# Altium schematic sheet Battery_Management.SchDoc
size A4; SheetNumber: 2
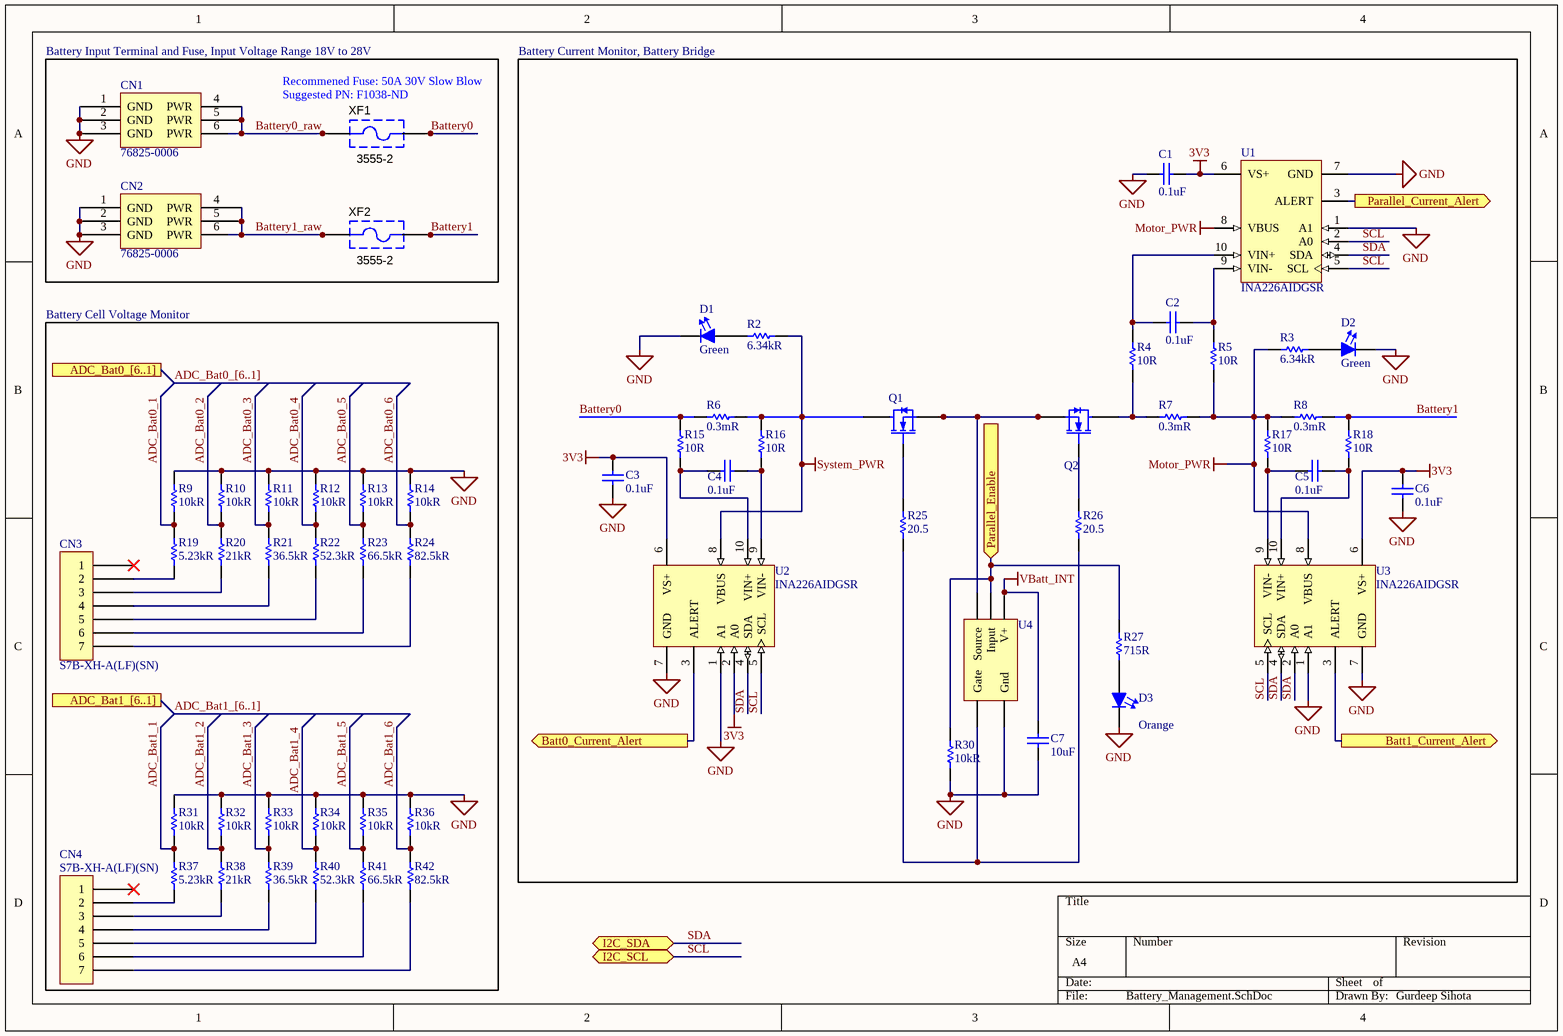
[diagram p0: Battery_Management.SchDoc]

## Parts
C1  Capacitance: 0.1uF  [FP-CL10-0_1-IPC_A]  (hidden comment: CL10B104JB8NNNC)
C2  Capacitance: 0.1uF  [FP-CL10-0_1-IPC_A]  (hidden comment: CL10B104JB8NNNC)
C3  Capacitance: 0.1uF  [FP-CL10-0_1-IPC_A]  (hidden comment: CL10B104JB8NNNC)
C4  Capacitance: 0.1uF  [FP-CL10-0_1-IPC_A]  (hidden comment: CL10B104JB8NNNC)
C5  Capacitance: 0.1uF  [FP-CL10-0_1-IPC_A]  (hidden comment: CL10B104JB8NNNC)
C6  Capacitance: 0.1uF  [FP-CL10-0_1-IPC_A]  (hidden comment: CL10B104JB8NNNC)
C7  Capacitance: 10uF  [CAPC3216X180X50ML20T30]  (hidden comment: CL31B106KBHNNNE)
CN1  76825-0006  [76825-0006-Footprint-1]
CN2  76825-0006  [76825-0006-Footprint-1]
CN3  S7B-XH-A(LF)(SN)  [S7B-XH-A(LF)(SN)-Footprint-1]
CN4  S7B-XH-A(LF)(SN)  [S7B-XH-A(LF)(SN)-Footprint-1]
D1  Color: Green  [FP-LB_Q39E-MFG]  (hidden comment: LT Q39G-Q1OO-25-1)
D2  Color: Green  [FP-LB_Q39E-MFG]  (hidden comment: LT Q39G-Q1OO-25-1)
D3  Colour: Orange  [LED0805]  (hidden comment: LED, 0805 (2012), Orange, Clear)
Q1  MOSFET N-Channel, 40V, 100A, 272W  [LFPAK-PowerSO8]  (value not drawn)
Q2  MOSFET N-Channel, 40V, 100A, 272W  [LFPAK-PowerSO8]  (value not drawn)
R2  Resistance: 6.34kR  [RESC1609X50X30ML10T20]  (hidden comment: CRCW06036K34FKEA)
R3  Resistance: 6.34kR  [RESC1609X50X30ML10T20]  (hidden comment: CRCW06036K34FKEA)
R4  Resistance: 10R  [FP-ERJ3EK-IPC_A]  (hidden comment: ERJ3EKF10R0V)
R5  Resistance: 10R  [FP-ERJ3EK-IPC_A]  (hidden comment: ERJ3EKF10R0V)
R6  Resistance: 0.3mR  [RESC6332N(2512")]  (hidden comment: HCS2512FTL300)
R7  Resistance: 0.3mR  [RESC6332N(2512")]  (hidden comment: HCS2512FTL300)
R8  Resistance: 0.3mR  [RESC6332N(2512")]  (hidden comment: HCS2512FTL300)
R9  Resistance: 10kR  [RESC1608X55X25ML10T15]  (hidden comment: RC0603FR-0710KL)
R10  Resistance: 10kR  [RESC1608X55X25ML10T15]  (hidden comment: RC0603FR-0710KL)
R11  Resistance: 10kR  [RESC1608X55X25ML10T15]  (hidden comment: RC0603FR-0710KL)
R12  Resistance: 10kR  [RESC1608X55X25ML10T15]  (hidden comment: RC0603FR-0710KL)
R13  Resistance: 10kR  [RESC1608X55X25ML10T15]  (hidden comment: RC0603FR-0710KL)
R14  Resistance: 10kR  [RESC1608X55X25ML10T15]  (hidden comment: RC0603FR-0710KL)
R15  Resistance: 10R  [FP-ERJ3EK-IPC_A]  (hidden comment: ERJ3EKF10R0V)
R16  Resistance: 10R  [FP-ERJ3EK-IPC_A]  (hidden comment: ERJ3EKF10R0V)
R17  Resistance: 10R  [FP-ERJ3EK-IPC_A]  (hidden comment: ERJ3EKF10R0V)
R18  Resistance: 10R  [FP-ERJ3EK-IPC_A]  (hidden comment: ERJ3EKF10R0V)
R19  Resistance: 5.23kR  [RESC1608X55X30ML15T15]  (hidden comment: ERJ-3EKF5231V)
R20  Resistance: 21kR  [RESC1608X55X30ML15T15]  (hidden comment: ERJ-3EKF2102V)
R21  Resistance: 36.5kR  [RESC1608X55X30ML15T15]  (hidden comment: ERJ3EKF3652V)
R22  Resistance: 52.3kR  [RESC1608X55X30ML15T15]  (hidden comment: ERJ-3EKF5232V)
R23  Resistance: 66.5kR  [RESC1608X55X30ML15T15]  (hidden comment: ERJ-3EKF6652V)
R24  Resistance: 82.5kR  [RESC1608X55X30ML15T15]  (hidden comment: ERJ-3EKF8252V)
R25  value 20.5  [RESC1608N(0603")]  (hidden comment: 20.5 Ohm, 1%, 1/10W , 0603, SMD)
R26  value 20.5  [RESC1608N(0603")]  (hidden comment: 20.5 Ohm, 1%, 1/10W , 0603, SMD)
R27  value 715R  [RESC1608N(0603")]  (hidden comment: 715R, 1%, 1/10W, 0603, SMD)
R30  Resistance: 10kR  [RESC1608X55X25ML10T15]  (hidden comment: RC0603FR-0710KL)
R31  Resistance: 10kR  [RESC1608X55X25ML10T15]  (hidden comment: RC0603FR-0710KL)
R32  Resistance: 10kR  [RESC1608X55X25ML10T15]  (hidden comment: RC0603FR-0710KL)
R33  Resistance: 10kR  [RESC1608X55X25ML10T15]  (hidden comment: RC0603FR-0710KL)
R34  Resistance: 10kR  [RESC1608X55X25ML10T15]  (hidden comment: RC0603FR-0710KL)
R35  Resistance: 10kR  [RESC1608X55X25ML10T15]  (hidden comment: RC0603FR-0710KL)
R36  Resistance: 10kR  [RESC1608X55X25ML10T15]  (hidden comment: RC0603FR-0710KL)
R37  Resistance: 5.23kR  [RESC1608X55X30ML15T15]  (hidden comment: ERJ-3EKF5231V)
R38  Resistance: 21kR  [RESC1608X55X30ML15T15]  (hidden comment: ERJ-3EKF2102V)
R39  Resistance: 36.5kR  [RESC1608X55X30ML15T15]  (hidden comment: ERJ3EKF3652V)
R40  Resistance: 52.3kR  [RESC1608X55X30ML15T15]  (hidden comment: ERJ-3EKF5232V)
R41  Resistance: 66.5kR  [RESC1608X55X30ML15T15]  (hidden comment: ERJ-3EKF6652V)
R42  Resistance: 82.5kR  [RESC1608X55X30ML15T15]  (hidden comment: ERJ-3EKF8252V)
U1  INA226AIDGSR  [DGS0010A_M]
U2  INA226AIDGSR  [DGS0010A_M]
U3  INA226AIDGSR  [DGS0010A_M]
U4  MIC5014YM-TR  [SOC 8]  (value not drawn)
XF1  3555-2  [3555-2-Footprint-1]
XF2  3555-2  [3555-2-Footprint-1]

## Blocks framed on the sheet
Battery Current Monitor, Battery Bridge: C1-C7 D1-D3 Q1 Q2 R2-R8 R15-R18 R25-R27 R30 U1-U4
Battery Cell Voltage Monitor: CN3 CN4 R9-R14 R19-R24 R31-R42

## Ports
ADC_Bat0_[6..1], ADC_Bat1_[6..1], Batt0_Current_Alert (out), Batt1_Current_Alert (out), I2C_SCL (bidir), I2C_SDA (bidir), Parallel_Current_Alert (out), Parallel_Enable (in)

## Nets
3V3: C1.1 C3.1 C6.1 U1.6(VS+) U2.2(A0) U2.6(VS+) U3.6(VS+)
GND: C1.2 C3.2 C6.2 C7.2 CN1.1(GND) CN1.2(GND) CN1.3(GND) CN2.1(GND) CN2.2(GND) CN2.3(GND) D1.1(Cathode) D2.1(Cathode) D3.1(Cathode) R9.2 R10.1 R11.2 R12.2 R13.2 R14.2 R30.1 R31.1 R32.1 R33.2 R34.2 R35.2 R36.2 U1.1(A1) U1.7(GND) U2.1(A1) U2.7(GND) U3.1(A1) U3.7(GND) U4.4(Gnd)
Motor_PWR: R3.1 R5.1 R7.2 R8.1 R17.1 U1.8(VBUS) U3.8(VBUS)
System_PWR: Q1.5(Drain) R2.2 R6.2 R16.1 U2.8(VBUS)
VBatt_INT: C7.1 U4.1(V+)
ADC_Bat0_1: R9.1 R19.2
ADC_Bat0_2: R10.2 R20.2
ADC_Bat0_3: R11.1 R21.2
ADC_Bat0_4: R12.1 R22.1
ADC_Bat0_5: R13.1 R23.2
ADC_Bat0_6: R14.1 R24.2
ADC_Bat1_1: R31.2 R37.2
ADC_Bat1_2: R32.2 R38.2
ADC_Bat1_3: R33.1 R39.2
ADC_Bat1_4: R34.1 R40.1
ADC_Bat1_5: R35.1 R41.2
ADC_Bat1_6: R36.1 R42.2
Batt0_Current_Alert: U2.3(ALERT) ; port Batt0_Current_Alert
Batt1_Current_Alert: U3.3(ALERT) ; port Batt1_Current_Alert
Battery0: R6.1 R15.1 XF1.3 XF1.4
Battery0_raw: CN1.4(PWR) CN1.5(PWR) CN1.6(PWR) XF1.1 XF1.2
Battery1: R8.2 R18.1 XF2.3 XF2.4
Battery1_raw: CN2.4(PWR) CN2.5(PWR) CN2.6(PWR) XF2.1 XF2.2
Parallel_Current_Alert: U1.3(ALERT) ; port Parallel_Current_Alert
Parallel_Enable: R27.1 R30.2 U4.2(Input) ; port Parallel_Enable
SCL: U1.2(A0) U1.5(SCL) U2.5(SCL) U3.5(SCL) ; port I2C_SCL
SDA: U1.4(SDA) U2.4(SDA) U3.2(A0) U3.4(SDA) ; port I2C_SDA
NetC2_1: C2.1 R4.2 U1.10(VIN+)
NetC2_2: C2.2 R5.2 U1.9(VIN-)
NetC4_1: C4.1 R16.2 U2.9(VIN-)
NetC4_2: C4.2 R15.2 U2.10(VIN+)
NetC5_1: C5.1 R18.2 U3.10(VIN+)
NetC5_2: C5.2 R17.2 U3.9(VIN-)
NetCN3_2: CN3.2 R19.1
NetCN3_3: CN3.3 R20.1
NetCN3_4: CN3.4 R21.1
NetCN3_5: CN3.5 R22.2
NetCN3_6: CN3.6 R23.1
NetCN3_7: CN3.7 R24.1
NetCN4_2: CN4.2 R37.1
NetCN4_3: CN4.3 R38.1
NetCN4_4: CN4.4 R39.1
NetCN4_5: CN4.5 R40.2
NetCN4_6: CN4.6 R41.1
NetCN4_7: CN4.7 R42.1
NetD1_2: D1.2(Anode) R2.1
NetD2_2: D2.2(Anode) R3.2
NetD3_2: D3.2(Anode) R27.2
NetQ1_1: Q1.1(Source) Q1.2(Source) Q1.3(Source) Q2.1(Source) Q2.2(Source) Q2.3(Source) U4.3(Source)
NetQ1_4: Q1.4(Gate) R25.2
NetQ2_4: Q2.4(Gate) R26.2
NetQ2_5: Q2.5(Drain) R4.1 R7.1
NetR25_1: R25.1 R26.1 U4.5(Gate)

Not connected (* = marked no-connect by the designer): CN3 1*; CN4 1*

## Buses and harness runs
bus ADC_Bat0_[6..1] = port ADC_Bat0_[6..1]
bus ADC_Bat1_[6..1] = port ADC_Bat1_[6..1]

## Notes on the sheet
- Battery Input Terminal and Fuse, Input Voltage Range 18V to 28V
- (near XF1) Recommened Fuse: 50A 30V Slow Blow
  Suggested PN: F1038-ND
- Gurdeep Sihota

## Library data of the parts
C1-C6 = CMP-00000-4: CAP CER 0.1UF 50V X7R 0603; Tolerance: 5%; Material: Ceramic; Case Code (Imperial): 0603; Mount: Surface Mount; Thickness: 0.035inch; Depth: 0.8mm; Packaging: Tape and Reel; Package Quantity: 1; Dielectric: X7R; Height: 0.8mm; Voltage: 50V; Radiation Hardening: No; Max Operating Temperature: 125°C; Voltage Rating: 50V; Case/Package: 0603; Min Operating Temperature: -55°C; Case Code (Metric): 1608; Length: 1.6mm; Contact Plating: Tin; Width: 0.031inch
C7 = CMP-00004-2: Cap Ceramic 10uF 50V X7R 10% Pad SMD 1206 125°C T/R; Thickness: 0.071inch; Case/Package: 1206; Case Code (Metric): 3216; Case Code (Imperial): 1206; Voltage Rating: 50V; Length: 0.126inch; Max Operating Temperature: 125°C; Voltage Rating (DC): 50V; Dielectric: X7R; Lead Free: Lead Free; Min Operating Temperature: -55°C; Tolerance: 10%; Mount: Surface Mount; Packaging: Tape and Reel; Width: 0.063inch
CN1 CN2 = CMP-00049-2: CONNECTOR, HEADER, 6POS, 2ROW, 5.7MM; Product Range:Mega-Fit 76825 Series; Contact Termination Type:Through Hole; Gender:Header; No. of Contacts:6; Pitch Spacing:5.7mm; Contact Plating:Tin Plated Contacts; Contact Material:Copper; Number of Circuits: 6; Gender: Male; Mount: Through Hole; Color: Black; Number of Rows: 2; Contact Material: Copper; Termination: Through Hole; Orientation: Right Angle; Number of Pins: 6; Pitch: 5.7mm; REACH SVHC: Unknown; Contact Plating: Tin; Number of Contacts: 6
CN3 CN4 = CMP-00017-1: CONN HEADER XH SIDE 7POS 2.5MM; Current Rating: 3A; Voltage Rating: 250V; Gender: Male; Wire/Cable Gauge: 22AWG; Connector Type: Header,Male Pin; Insulation Resistance: 1GR; Number of Positions: 7; Contact Resistance: 10mR; Packaging: Bulk; Pitch: 2.5mm; Number of Rows: 1; Lead Pitch: 2.5mm; REACH SVHC: No SVHC; Orientation: Right Angle; Contact Material: Brass; Package Quantity: 250; Flammability Rating: UL94 V-0; Mount: Through Hole; Lead Free: Lead Free; Contact Shape: Square; Termination: Solder; Insulation Material: Nylon; Min Operating Temperature: -25°C; Max Operating Temperature: 85°C; Contact Plating: Tin,Lead; Number of Contacts: 7; Fastening Type: Detent; Voltage Rating (AC): 250V; Color: Natural; Insulation Color: Natural
D1 D2 = CMP-00064-3: LED GREEN DIFFUSED 0603 SMD; Dominant Wavelength: 530nm; Luminous Intensity: 280mcd; Lens Style: Diffused,Colorless,Rectangular; Number of LEDs: 1; Forward Voltage: 2.85V; Test Current: 5mA; Reverse Voltage: 5V; Forward Current: 15mA; Luminous Flux: 0.55lm; Radiation Hardening: No; Packaging: Tape and Reel; Mount: Surface Mount; Max Operating Temperature: 85°C; Number of Elements: 1; Number of Pins: 2; Min Operating Temperature: -40°C; Depth: 0.9mm; Case/Package: SMD/SMT; Length: 1.7mm
D3 = CMP-057-0010-2: Pin Count: 2; Source: AUVic_Schematic_Library_Diodes.SchLib; Component Type: Standard; ComponentLink1Description: Digikey; ComponentLink1URL: https://www.digikey.ca/product-detail/en/lite-on-inc/LTST-C170KFKT/160-1413-1-ND/386774; Created By: Robert Keen; Design Item ID: LED, 0805 (2012), Orange, Clear
Q1 Q2 = CMP-052-0019-1: MOSFET N-Channel, 40V, 100A, 272W, Enh-Mode; MFG#: PSMN1R8-40YLC,115; MFG: NXP Semiconductors; Reviewed_By: Ashwin Sira; Latest_Revision_Note: Attached footprint; Publisher: AUVic; Design Item ID: MOSFET N-Channel, 40V, 100A, 272W; Created By: Ashwin Sira; Component Type: Standard; Latest_Revision_Date: 2016_04_26; Source: AUVic_Schematic_Library_Transistors.SchLib; Latest_Revision_By: Ashwin Sira; Reviewed_Date: 2016_04_26; Pin Count: 5
R2 R3 = CMP-00072-2: VISHAY         CRCW06036K34FKEA.             SMD Chip Resistor, Thick Film, 6.34 kohm, 75 V, 0603 [1608 Metric], 100 mW,  1%, CRCW Series; Voltage Rating: 75V; Power Rating: 100mW; Temperature Coefficient: 100ppm/°C; Depth: 0.85mm; Military Standard: Not; Composition: Thick Film; Case Code (Metric): 1608; Case/Package: 0603; Packaging: Tape and Reel; Max Operating Temperature: 155°C; Tolerance: 1%; Height: 0.45mm; Package Quantity: 10; Case Code (Imperial): 0603; Width: 0.033inch; Length: 1.55mm; REACH SVHC: Unknown; Termination: SMD/SMT; Radiation Hardening: No; Contact Plating: Tin; Weight: 7.1E-05oz; Number of Pins: 2; Min Operating Temperature: -55°C; Features: Automotive AEC-Q200; Number of Terminations: 2; Max Power Dissipation: 100mW
R4 R5 R15-R18 = CMP-00034-3: PANASONIC - ERJ3EKF10R0V - SMD Chip Resistor, 0603 [1608 Metric], 10 ohm, ERJ3EK Series, 75 V, Thick Film, 100 mW; Temperature Coefficient: 100ppm/°C; Tolerance: 1%; Max Power Dissipation: 100mW; Voltage Rating (DC): 75V; Package Quantity: 5000; Case Code (Imperial): 0603; Military Standard: Not; Depth: 0.8mm; Number of Terminations: 2; Working Voltage: 75V; Min Operating Temperature: -55°C; Width: 0.8mm; Composition: Thick Film; Packaging: Tape and Reel; Power Rating: 100mW; REACH SVHC: No SVHC; Max Operating Temperature: 155°C; Case Code (Metric): 1608; Features: Automotive AEC-Q200; Case/Package: 0603; Length: 1.6mm; Number of Pins: 2; Lead Free: Lead Free; Height: 0.45mm; Voltage Rating: 75V; Contact Plating: Tin; Termination: SMD/SMT; Mount: Surface Mount; Radiation Hardening: No
R6-R8 = CMP-047-0000-2: 300 µOhms ±1% 3W Chip Resistor 2512 (6432 Metric) Automotive AEC-Q200, Current Sense, Moisture Resistant Metal Element; Temperature Coefficient: 150ppm/°C; Features: Moisture Resistant,Automotive AEC-Q200; Max Operating Temperature: 170°C; Length: 0.256inch; Tolerance: 1%; Case Code (Imperial): 2512; Case Code (Metric): 6432; Min Operating Temperature: -55°C; Number of Terminations: 2; Height: 0.038inch; Packaging: Cut Tape; Case/Package: 2512; Width: 0.128inch; Package Quantity: 4000; Composition: Metal Element; Max Power Dissipation: 3W
R9-R14 R30-R36 = CMP-00037-2: Res General Purpose Thick Film 0603 10K Ohm 1% 1/10W ±100ppm/°C Molded SMD Paper T/R; Power Rating: 100mW; Voltage Rating (DC): 50V; Voltage Rating: 75V; Case/Package: 0603; Weight: 7.1E-05oz; Case Code (Imperial): 0603; Composition: Thick Film; Depth: 0.8mm; Min Operating Temperature: -55°C; Width: 0.8mm; Height: 0.45mm; Military Standard: Not; Packaging: Tape and Reel; Termination: SMD/SMT; Lead Free: Lead Free; Temperature Coefficient: 100ppm/°C; Number of Pins: 2; Max Operating Temperature: 155°C; Lead Pitch: 0.3mm; REACH SVHC: No SVHC; Case Code (Metric): 1608; Tolerance: 1%; Length: 1.6mm
R19 R37 = CMP-00080-2: GLOVE, POLYAMIDE, L/FREE, PU, SIZE 6 - More Details; Power Rating: 100mW; Temperature Coefficient: 100ppm/°C; Voltage Rating (DC): 50V; Voltage Rating: 75V; Tolerance: 1%; Case/Package: 0603; Case Code (Imperial): 0603; Composition: Thick Film; Depth: 0.8mm; Min Operating Temperature: -55°C; Width: 0.031inch; Height: 0.022inch; Military Standard: Not; Packaging: Tape and Reel; Termination: SMD/SMT; Lead Free: Lead Free; Max Operating Temperature: 155°C; REACH SVHC: No SVHC; Case Code (Metric): 1608; Length: 1.6mm; Radiation Hardening: No; Contact Plating: Tin; Package Quantity: 1; Number of Terminations: 2; Max Power Dissipation: 100mW; Features: Automotive AEC-Q200; Mount: Surface Mount
R20 R38 = CMP-00081-2: RESISTOR, 0603, 21K 1%, 0.1W; Power Rating: 100mW; Temperature Coefficient: 100ppm/°C; Voltage Rating (DC): 50V; Voltage Rating: 75V; Case/Package: 0603; Case Code (Imperial): 0603; Composition: Thick Film; Depth: 0.8mm; Min Operating Temperature: -55°C; Width: 0.8mm; Height: 0.022inch; Military Standard: Not; Packaging: Tape and Reel; Termination: SMD/SMT; Lead Free: Lead Free; Max Operating Temperature: 155°C; REACH SVHC: Unknown; Case Code (Metric): 1608; Tolerance: 1%; Length: 1.6mm; Working Voltage: 75V; Radiation Hardening: No; Max Power Dissipation: 100mW; Package Quantity: 1; Contact Plating: Tin; Mount: Surface Mount; Number of Terminations: 2; Features: Automotive AEC-Q200
R21 R39 = CMP-00082-2: PANASONIC - ERJ3EKF3652V - SMD Chip Resistor, 0603 [1608 Metric], 36.5 kohm, ERJ3EK Series, 75 V, Thick Film, 100 mW; Power Rating: 100mW; Temperature Coefficient: 100ppm/°C; Voltage Rating (DC): 50V; Voltage Rating: 75V; Tolerance: 1%; Case/Package: 0603; Case Code (Imperial): 0603; Composition: Thick Film; Depth: 0.8mm; Min Operating Temperature: -55°C; Width: 0.031inch; Height: 0.45mm; Military Standard: Not; Packaging: Tape and Reel; Termination: SMD/SMT; Lead Free: Lead Free; Max Operating Temperature: 155°C; REACH SVHC: No SVHC; Case Code (Metric): 1608; Length: 1.6mm; Package Quantity: 5000; Contact Plating: Tin; Radiation Hardening: No; Mount: Surface Mount; Number of Terminations: 2; Features: Automotive AEC-Q200; Max Power Dissipation: 100mW
R22 R40 = CMP-00083-2: ICK FILM, RESISTOR, 52.3KOHM, 100mW, ±1%; Product Range:PANASONIC - ERJ Series; Resistance:52.3kohm; Power Rating:100mW; Resistance Tolerance:± 1%; Resistor Case Style:0603 ^1608 Metric]; Resistor Element Type:Thick Film; MSL:-; Temperature Coefficient: 100ppm/°C; Voltage Rating: 75V; Voltage Rating (DC): 50V; Case/Package: 0603; Case Code (Imperial): 0603; Composition: Thick Film; Depth: 0.8mm; Power Rating: 100mW; Min Operating Temperature: -55°C; Width: 0.8mm; Height: 0.022inch; Military Standard: Not; Packaging: Tape and Reel; Termination: SMD/SMT; Max Operating Temperature: 155°C; REACH SVHC: No SVHC; Case Code (Metric): 1608; Tolerance: 1%; Length: 1.6mm; Radiation Hardening: No; Max Power Dissipation: 100mW; Contact Plating: Tin; Number of Terminations: 2; Features: Automotive AEC-Q200; Package Quantity: 1; Mount: Surface Mount; Lead Free: Lead Free
R23 R41 = CMP-00084-2: SISTOR, THICK FILM, 66.5KOHM, 100mW,1%; Product Range:PANASONIC - ERJ Series; Resistance:66.5kohm; Power Rating:100mW; Resistance Tolerance:± 1%; Resistor Case Style:0603 ^1608 Metric]; Resistor Element Type:Thick Film; MSL:-; Temperature Coefficient: 100ppm/°C; Voltage Rating (DC): 50V; Voltage Rating: 75V; Case/Package: 0603; Case Code (Imperial): 0603; Composition: Thick Film; Depth: 0.8mm; Power Rating: 100mW; Min Operating Temperature: -55°C; Width: 0.8mm; Height: 0.022inch; Military Standard: Not; Packaging: Tape and Reel; Termination: SMD/SMT; Lead Free: Lead Free; Max Operating Temperature: 155°C; REACH SVHC: Yes; Case Code (Metric): 1608; Tolerance: 1%; Length: 1.6mm; Package Quantity: 1; Contact Plating: Tin; Features: Automotive AEC-Q200; Max Power Dissipation: 100mW; Number of Terminations: 2; Radiation Hardening: No; Mount: Surface Mount
R24 R42 = CMP-00085-2: RES SMD 82.5K OHM 1% 1/10W 0603; Power Rating: 100mW; Temperature Coefficient: 100ppm/°C; Voltage Rating (DC): 50V; Voltage Rating: 75V; Case/Package: 0603; Case Code (Imperial): 0603; Composition: Thick Film; Depth: 0.8mm; Min Operating Temperature: -55°C; Width: 0.031inch; Height: 0.022inch; Military Standard: Not; Packaging: Tape and Reel; Termination: SMD/SMT; Lead Free: Lead Free; Max Operating Temperature: 155°C; REACH SVHC: No SVHC; Case Code (Metric): 1608; Tolerance: 1%; Length: 1.6mm; Features: Automotive AEC-Q200; Package Quantity: 1; Max Power Dissipation: 100mW; Radiation Hardening: No; Contact Plating: Tin; Number of Terminations: 2; Mount: Surface Mount
R25 R26 = CMP-047-0030-1: Date Created: 2017-06-23; Source: AUVic_Schematic_Library_Resistors.SchLib; Pin Count: 2; Publisher: AUVic; Design Item ID: 20.5 Ohm, 1%, 1/10W , 0603, SMD; Created By: Gabriel Green; Component Type: Standard
R27 = CMP-047-0066-1: Design Item ID: 715R, 1%, 1/10W, 0603, SMD; Source: AUVic_Schematic_Library_Resistors.SchLib; Publisher: AUVic; Created By: Ashwin Sira; Pin Count: 2; Component Type: Standard; Date Created: 2016-06-10
U1-U3 = CMP-00032-1: Bi Directional Current and Power Monitor 10-Pin VSSOP T/R; Nominal Supply Current: 330uA; Common Mode Rejection Ratio: 140dB; Output Current: 10mA; Accuracy: 0.02%; Input Bias Current: 10uA; Input Offset Voltage (Vos): 2.5uV; Min Supply Voltage: 2.7V; Max Supply Voltage: 5.5V; Mount: Surface Mount; Case/Package: VSSOP; Contact Plating: Gold; Radiation Hardening: No; Packaging: Tape and Reel; Package Quantity: 1; Max Operating Temperature: 125°C; Lead Free: Lead Free; Number of Pins: 10; Min Operating Temperature: -40°C; REACH SVHC: No SVHC
U4 = CMP-028-0000-2: High-Side or Low-Side Gate Driver IC Non-Inverting 8-SOIC; Number of Drivers: 1; Turn-On Delay Time: 8ms; Min Supply Voltage: 2.75V; Max Supply Voltage: 30V; Turn-Off Delay Time: 30us; Channel Type: Single; Max Output Current: 10mA; Lead Free: Lead Free; Max Operating Temperature: 85°C; Number of Pins: 8; Min Operating Temperature: -40°C; Height: 1.48mm; Mount: Surface Mount; Package Quantity: 2500; Case/Package: SOIC; Packaging: Tape and Reel; Number of Outputs: 1; Width: 3.94mm; Length: 4.93mm
XF1 XF2 = CMP-00058-1: FUSE HOLDER MAXI AUTO BLADE PC; Current Rating: 40A; Voltage Rating (AC): 500V; Number of Poles: 1; Illumination Type: Illuminated; Fuse Type: Automotive; Approvals: UL; Body Material: Nylon,Glass; REACH SVHC: No SVHC; Lead Free: Lead Free; Max Operating Temperature: 145°C; Fuse Current: 40A; Min Operating Temperature: -50°C; Voltage: 500V; Contact Material: Copper,Tin; Orientation: Vertical; Package Quantity: 100; Depth: 5.9mm; Color: Black; Contact Plating: Nickel; Termination: PC Pin; Material: Copper,Brass,Tin,Nylon; Number of Circuits: 1; Mount: Vertical,PCB; Length: 35.8mm